# Altium schematic sheet Recifiler1.SchDoc
size A4
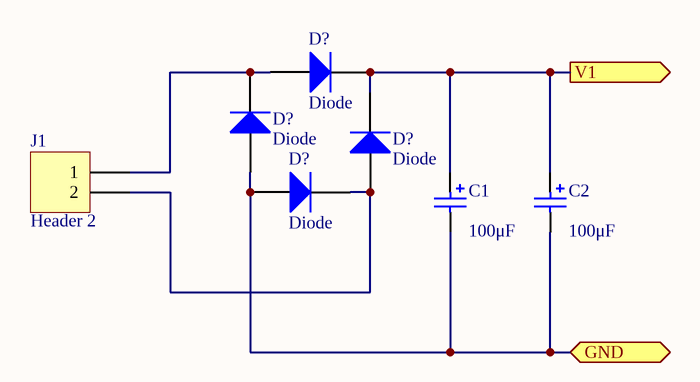
[diagram p0: Recifiler1.SchDoc]

## Parts
(Parts that share a designator on the sheet are numbered #1, #2 ... from top to bottom, then left to right.)
C1  value 100μF  [POLAR0.8]  (hidden comment: Cap Pol2)
C2  value 100μF  [POLAR0.8]  (hidden comment: Cap Pol2)
D?#1  Diode  [DSO-C2/X3.3]
D?#2  Diode  [DSO-C2/X3.3]
D?#3  Diode  [DSO-C2/X3.3]
D?#4  Diode  [DSO-C2/X3.3]
J1  Header 2  [HDR1X2]

## Ports
GND (bidir), V1 (out)

## Nets
GND: C1.2 C2.2 D?#2.1(A) D?#4.1(A) ; port GND
V1: C1.1 C2.1 D?#1.2(K) D?#3.2(K) ; port V1
NetD?#1_1: D?#1.1(A) D?#2.2(K) J1.1
NetD?#3_1: D?#3.1(A) D?#4.2(K) J1.2

## Library data of the parts
C1 C2 = Cap Pol2: Polarized Capacitor (Axial); Published: 8-Jun-2000; LatestRevisionDate: 17-Jul-2002; LatestRevisionNote: Re-released for DXP Platform.; PackageReference: POLAR0.8; Publisher: Altium Limited
D?#1-D?#4 = Diode: Default Diode; Published: 8-Jun-2000; LatestRevisionDate: 17-Jul-2002; LatestRevisionNote: Re-released for DXP Platform.; PackageVersion: Sep-1996; PackageReference: SMC; Publisher: Altium Limited; Code_JEDEC: DO-214-AB
J1 = Header 2: Header, 2-Pin; LatestRevisionDate: 17-Jul-2002; LatestRevisionNote: Re-released for DXP Platform.; Publisher: Altium Limited